# EAGLE schematic Buck V1 (EAGLE 9.4.2)
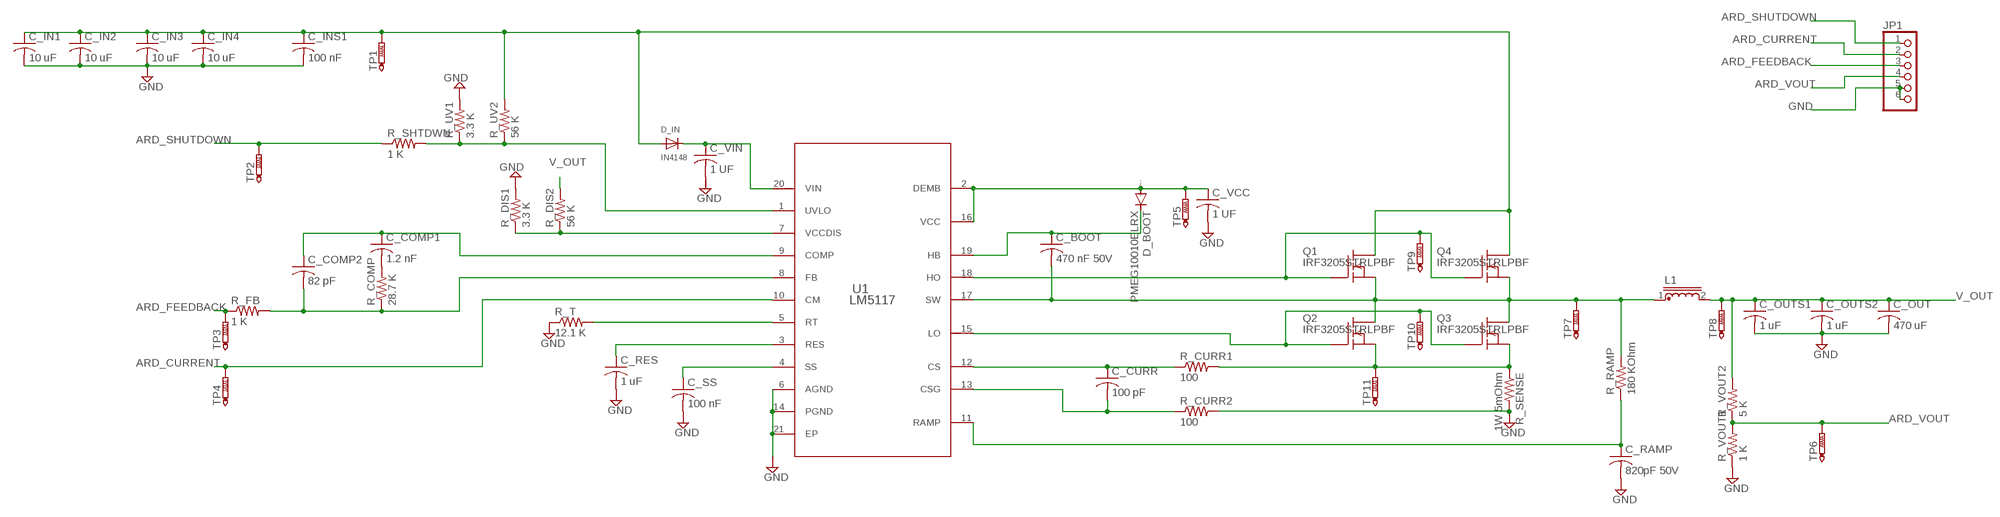
[diagram p0: schematic, sheet 1]

## Parts
C_BOOT  470 nF 50V  C-USC0603  [C0603]
C_COMP1  1.2 nF  C-USC0603  [C0603]
C_COMP2  82 pF  C-USC0603  [C0603]
C_CURR  100 pF  C-USC0603  [C0603]
C_IN1  10 uF  C-USC1206  [C1206]
C_IN2  10 uF  C-USC1206  [C1206]
C_IN3  10 uF  C-USC1206  [C1206]
C_IN4  10 uF  C-USC1206  [C1206]
C_INS1  100 nF  C-USC0603  [C0603]
C_OUT  470 uF  CAP_PANASONIC_H13  [CAP_PANASONIC_H13]
C_OUTS1  1 uF  C-USC0805  [C0805]
C_OUTS2  1 uF  C-USC0805  [C0805]
C_RAMP  820pF 50V  C-USC0603  [C0603]
C_RES  1 uF  C-USC0603  [C0603]
C_SS  100 nF  C-USC0603  [C0603]
C_VCC  1 UF  C-USC0603  [C0603]
C_VIN  1 UF  C-USC0603  [C0603]
D_BOOT  PMEG10010ELRX  DIODE-SOD123  [SOD123]
D_IN  IN4148  DIODESOD-123  [SOD-123]
JP1  PINHD-1X6  [1X06]
L1  17.5X17.5_INDUCTOR_SMD  [17.5X17.5_INDUCTOR_SMD]
Q1  IRF3205STRLPBF  IRF510D2PAK  [D2PAK]
Q2  IRF3205STRLPBF  IRF510D2PAK  [D2PAK]
Q3  IRF3205STRLPBF  IRF510D2PAK  [D2PAK]
Q4  IRF3205STRLPBF  IRF510D2PAK  [D2PAK]
R_COMP  28.7 K  R-US_R0603  [R0603]
R_CURR1  100  R-US_R0603  [R0603]
R_CURR2  100  R-US_R0603  [R0603]
R_DIS1  3.3 K  R-US_R0603  [R0603]
R_DIS2  56 K  R-US_R0603  [R0603]
R_FB  1 K  R-US_R0603  [R0603]
R_RAMP  180 KOhm  R-US_R0603  [R0603]
R_SENSE  1W 5mOhm  R-US_R2512  [R2512]
R_SHTDWN  1 K  R-US_R0603  [R0603]
R_T  12.1 K  R-US_R0603  [R0603]
R_UV1  3.3 K  R-US_R0603  [R0603]
R_UV2  56 K  R-US_R0603  [R0603]
R_VOUT1  1 K  R-US_R0603  [R0603]
R_VOUT2  5 K  R-US_R0603  [R0603]
TP1  PTR1TP20R  [TP20R]
TP2  PTR1TP20R  [TP20R]
TP3  PTR1TP20R  [TP20R]
TP4  PTR1TP20R  [TP20R]
TP5  PTR1TP20R  [TP20R]
TP6  PTR1TP20R  [TP20R]
TP7  PTR1TP20R  [TP20R]
TP8  PTR1TP20R  [TP20R]
TP9  PTR1TP20R  [TP20R]
TP10  PTR1TP20R  [TP20R]
TP11  PTR1TP20R  [TP20R]
U1  LM5117  LM5117PMHX/NOPB  [PWP0020A]

## Nets
ARD_CURRENT: JP1.2 TP4.TP U1.10(CM)
ARD_FEEDBACK: JP1.3 R_FB.1 TP3.TP
ARD_SHUTDOWN: JP1.1 R_SHTDWN.1 TP2.TP
ARD_VOUT: JP1.4 R_VOUT1.2 R_VOUT2.1 TP6.TP
GND: C_IN1.2 C_IN2.2 C_IN3.2 C_IN4.2 C_INS1.2 C_OUT.P$1 C_OUTS1.2 C_OUTS2.2 C_RAMP.2 C_RES.2 C_SS.2 C_VCC.2 C_VIN.2 JP1.5 JP1.6 R_CURR2.2 R_DIS1.2 R_SENSE.2 R_T.1 R_UV1.2 R_VOUT1.1 U1.6(AGND) U1.14(PGND) U1.21(EP)
N$1: C_VCC.1 D_BOOT.A TP5.TP U1.2(DEMB) U1.16(VCC)
N$2: C_BOOT.1 D_BOOT.C U1.19(HB)
N$3: C_BOOT.2 L1.1 Q1.3(S) Q2.2(D) Q3.2(D) Q4.3(S) R_RAMP.2 TP7.TP U1.17(SW)
N$4: Q2.3(S) Q3.3(S) R_CURR1.2 R_SENSE.1 TP11.TP
N$5: C_RAMP.1 R_RAMP.1 U1.11(RAMP)
N$7: Q2.1(G) Q3.1(G) TP10.TP U1.15(LO)
N$8: Q1.1(G) Q4.1(G) TP9.TP U1.18(HO)
N$9: C_COMP1.2 R_COMP.2
N$10: C_VIN.1 D_IN.C U1.20(VIN)
N$11: R_SHTDWN.2 R_UV1.1 R_UV2.1 U1.1(UVLO)
N$13: R_DIS1.1 R_DIS2.1 U1.7(VCCDIS)
N$14: C_COMP1.1 C_COMP2.1 U1.9(COMP)
N$15: C_COMP2.2 R_COMP.1 R_FB.2 U1.8(FB)
N$16: R_T.2 U1.5(RT)
N$17: C_RES.1 U1.3(RES)
N$18: C_SS.1 U1.4(SS)
N$19: C_CURR.1 R_CURR1.1 U1.12(CS)
N$20: C_CURR.2 R_CURR2.1 U1.13(CSG)
N$21: C_IN1.1 C_IN2.1 C_IN3.1 C_IN4.1 C_INS1.1 D_IN.A Q1.2(D) Q4.2(D) R_UV2.2 TP1.TP
V_OUT: C_OUT.P$2 C_OUTS1.1 C_OUTS2.1 L1.2 R_DIS2.2 R_VOUT2.2 TP8.TP

## Library data of the parts
C_BOOT C_IN4 C_OUTS1 C_OUTS2 C_RAMP C_VCC C_VIN = rcl:C-US: CAPACITOR, American symbol; SPICEPREFIX: C
C_COMP1 C_COMP2 C_CURR C_IN1-C_IN3 C_INS1 C_RES C_SS = rcl:C-US: CAPACITOR, American symbol
C_OUT = custom-parts:CAP_PANASONIC_H13
D_BOOT = diode:DIODE-: DIODE
D_IN = adafruit:DIODE: Diode SMADIODE - SMA Surface Mount Package 20V 1A Schottky Diode Digikey: 641-1014-6-ND DO-1N4148 - Through Hole Small Current Diode SOD-123 20V 1 A (.5mV Vf) Schottky Diode - Digikey: MBRX120TPMSCT-ND SOD-323 10V 570mA (.38mV Vf, 3ns) Schottky Diode - Digikey: ZLLS410CT-ND SOD-523 30V 30mA Schottky Diode (RB751S-40TE61) - Digikey: RB751S-40TE61CT-ND SOT23-R/W - SOT23 Package (R = Solder Paste/Reflow Ovens, W = Hand-Soldering) BAT54Film 40V 300mA - Digikey: 497-7162-1-ND
JP1 = adafruit:PINHD-1X6: PIN HEADER
L1 = custom-parts:17.5X17.5_INDUCTOR_SMD: YXMAC1770
Q1-Q4 = mixed_components:IRF510: N-Channel Enhancement MOSFET (HEXFET); 100V; 5,6A; 0,54Ohm
R_COMP R_CURR1 R_CURR2 R_DIS1 R_DIS2 R_FB R_SHTDWN R_T R_UV1 R_UV2 R_VOUT1 R_VOUT2 = rcl:R-US_: RESISTOR, American symbol
R_RAMP R_SENSE = rcl:R-US_: RESISTOR, American symbol; SPICEPREFIX: R
TP1-TP11 = testpad:PTR1: TEST PIN
U1 = AcceleratedDesigns_Lib:LM5117PMHX/NOPB; MANUFACTURER: Texas Instruments; PARTNUMBER: LM5117PMHXNOPB; REFDES: RefDes; TYPE: TYPE; VALUE: Value